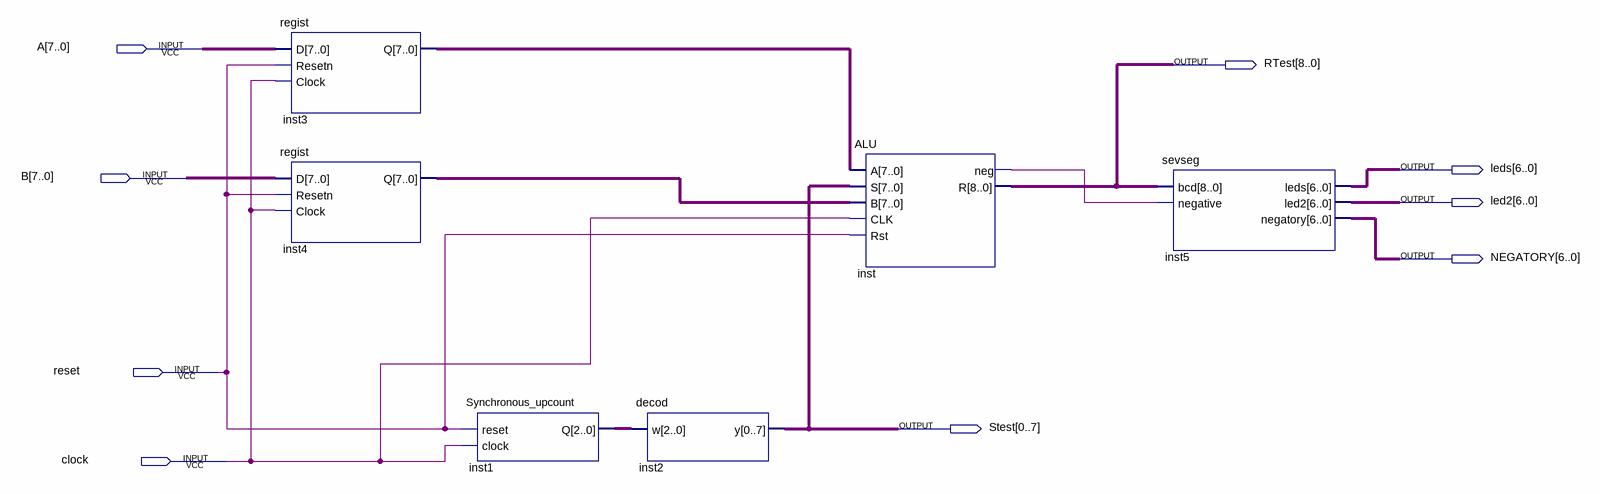
[diagram p0: schematic sheet]
// Quartus schematic intelcoreiBOSS.bdf as structural Verilog: 6 symbols, 9 pins
module intelcoreiBOSS (
  input  [7:0] A,
  input  [7:0] B,
  input  reset,
  input  clock,
  output [8:0] RTest,
  output [6:0] leds,
  output [6:0] led2,
  output [6:0] NEGATORY,
  output [0:7] Stest
);

  wire inst_neg;
  wire [2:0] inst1_q;
  wire [7:0] inst3_q, inst4_q;

  regist inst3 (.D(A), .Resetn(reset), .Clock(clock), .Q(inst3_q));
  regist inst4 (.D(B), .Resetn(reset), .Clock(clock), .Q(inst4_q));
  Synchronous_upcount inst1 (.reset(reset), .clock(clock), .Q(inst1_q));
  decod inst2 (.w(inst1_q), .y(Stest));
  ALU inst (.A(inst3_q), .S(Stest), .B(inst4_q), .CLK(clock), .Rst(reset), .neg(inst_neg), .R(RTest));
  sevseg inst5 (.bcd(RTest), .negative(inst_neg), .leds(leds), .led2(led2), .negatory(NEGATORY));
endmodule
